# Altium project ExtendBoard.PrjPCB
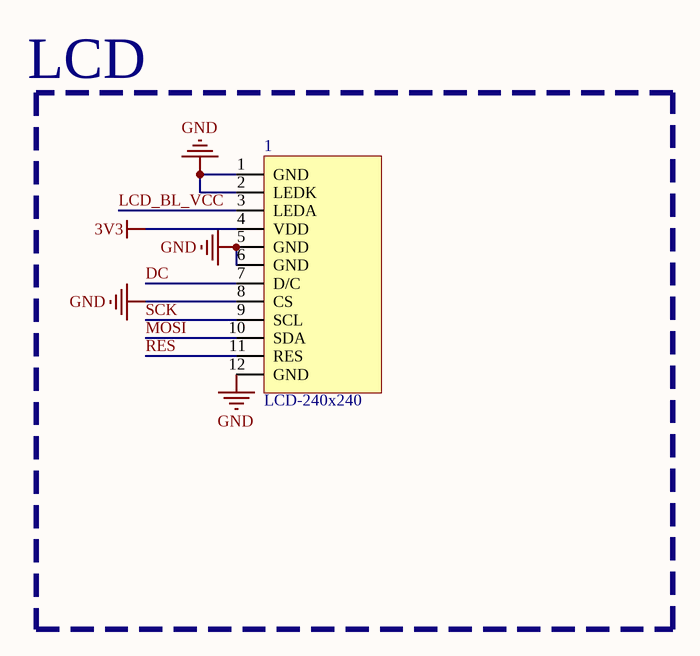
[diagram p0: Main.SchDoc]
1 sheet, 1 parts. Net scope: global (net labels, ports and power ports of the same name join across sheets).
Board file: ExtendBoard.PcbDoc

## Sheet Main.SchDoc
size 152 x 127 mm

### Parts
1  LCD-240x240  [LCD-240x240-NoHole]

### Nets
3V3: 1.4(VDD)
GND: 1.1(GND) 1.2(LEDK) 1.5(GND) 1.6(GND) 1.8(CS) 1.12(GND)
DC: 1.7(D/C)
LCD_BL_VCC: 1.3(LEDA)
MOSI: 1.10(SDA)
RES: 1.11(RES)
SCK: 1.9(SCL)

### Notes on the sheet
- LCD

### Library data of the parts
1 = LCD-240x240: 显示屏